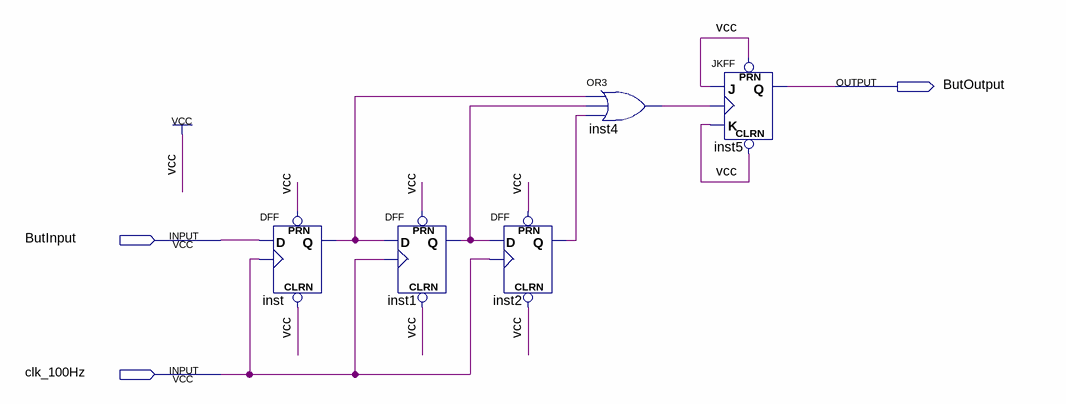
[diagram p0: schematic sheet]
// Quartus schematic but.bdf as structural Verilog: 5 symbols, 3 pins
module but (
  input  ButInput,
  input  clk_100Hz,
  output ButOutput
);

  wire inst1_q, inst2_q, inst4_out, inst_q;

  DFF inst (.CLRN(1'b1), .CLK(clk_100Hz), .D(ButInput), .PRN(1'b1), .Q(inst_q));
  DFF inst1 (.CLRN(1'b1), .CLK(clk_100Hz), .D(inst_q), .PRN(1'b1), .Q(inst1_q));
  DFF inst2 (.CLRN(1'b1), .CLK(clk_100Hz), .D(inst1_q), .PRN(1'b1), .Q(inst2_q));
  or inst4 (inst4_out, inst_q, inst1_q, inst2_q);
  JKFF inst5 (.PRN(1'b1), .CLRN(1'b1), .K(1'b1), .J(1'b1), .CLK(inst4_out), .Q(ButOutput));
endmodule
